# Altium schematic sheet RS485-Interface.SchDoc
size 279 x 320 mm; SheetNumber: 7; SheetTotal: 11
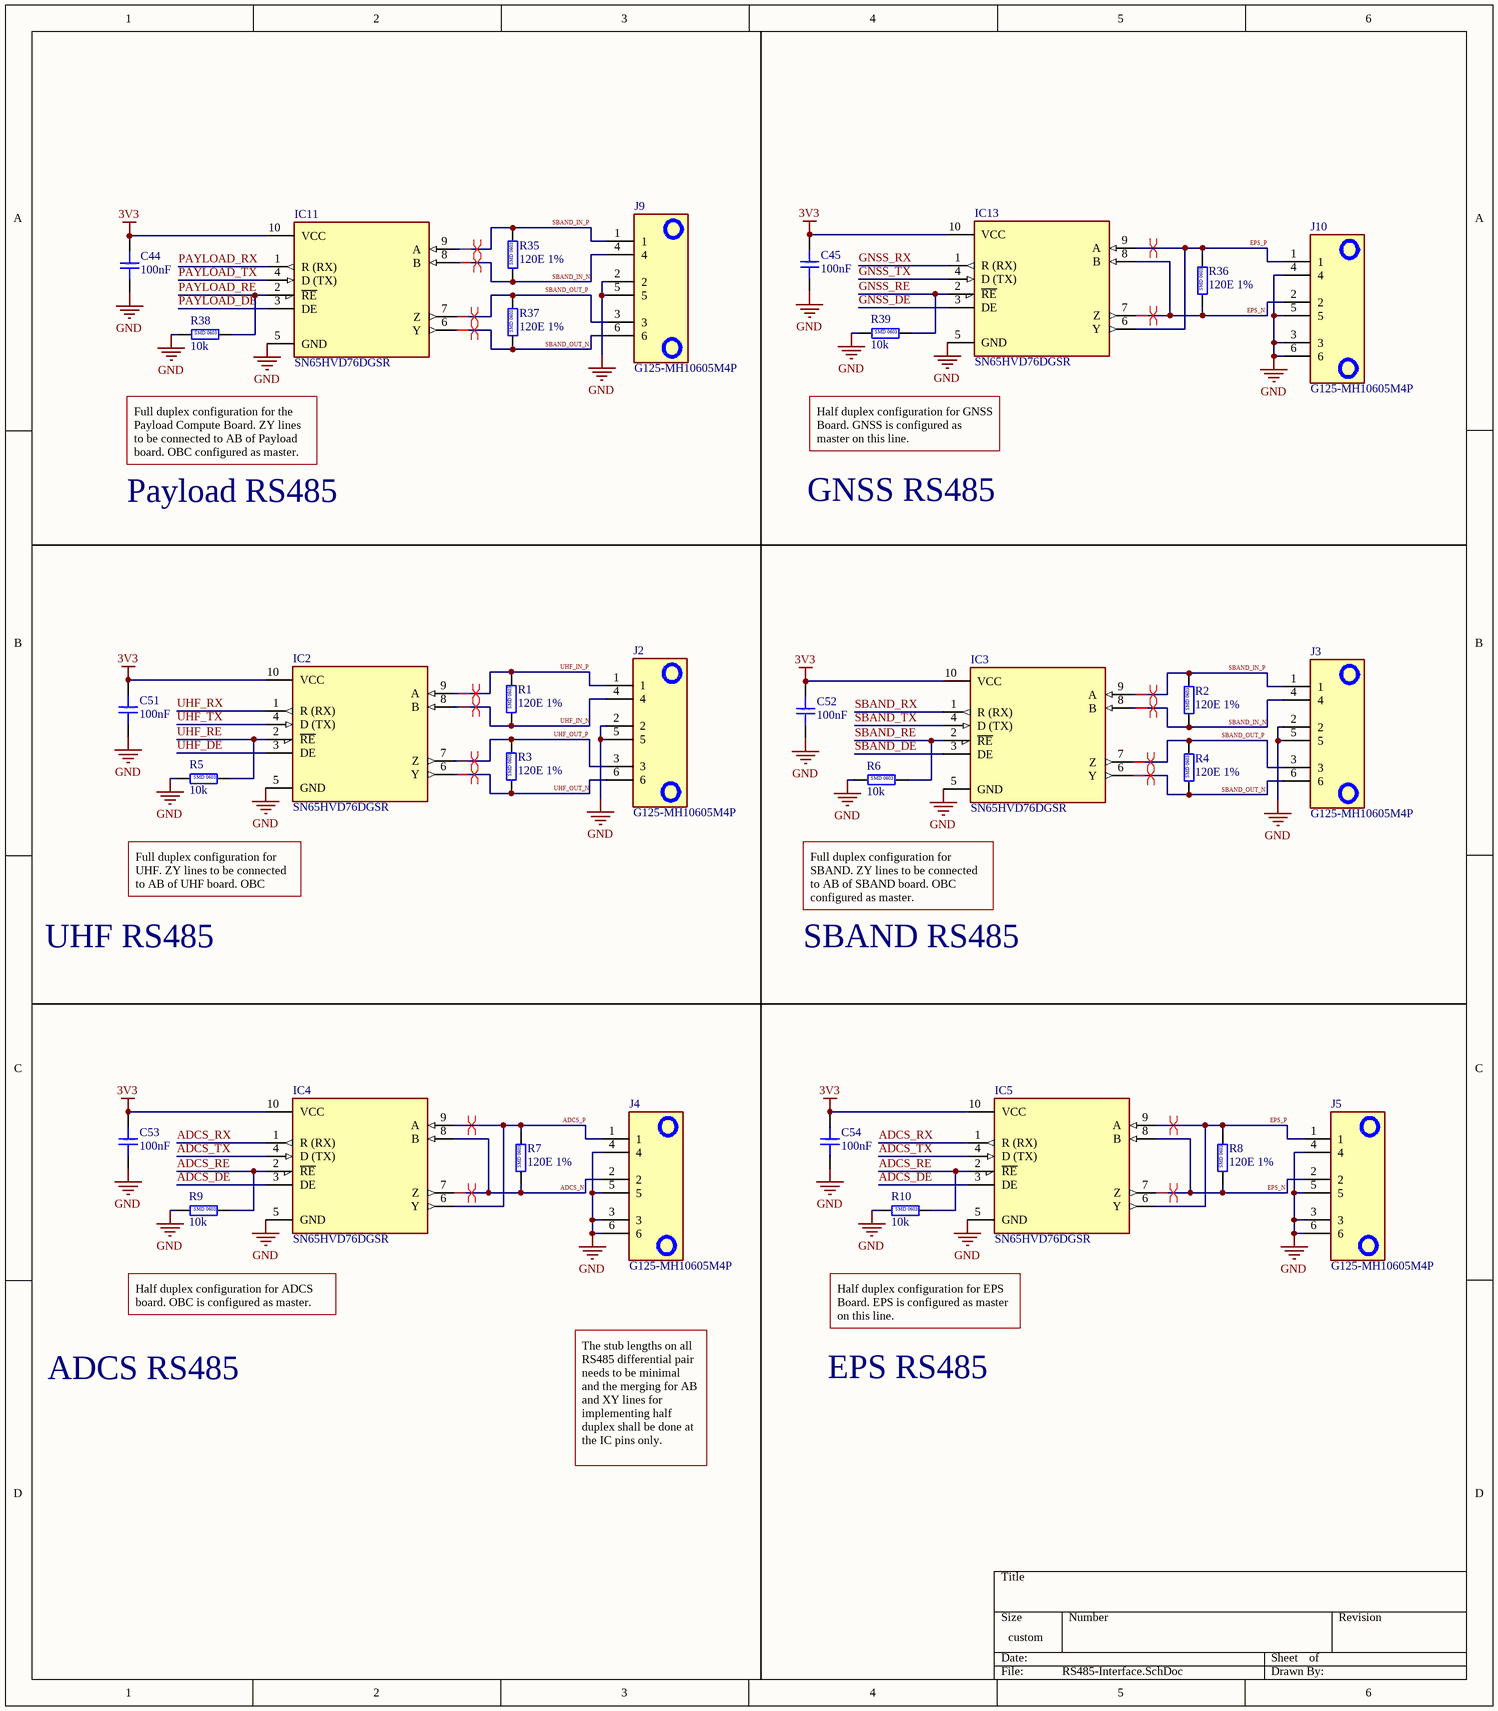
[diagram p0: RS485-Interface.SchDoc]

## Parts
C44  100nF  [CAP_0402]
C45  100nF  [CAP_0402]
C51  100nF  [CAP_0402]
C52  100nF  [CAP_0402]
C53  100nF  [CAP_0402]
C54  100nF  [CAP_0402]
IC2  SN65HVD76DGSR  [SOP50P490X110-10N]
IC3  SN65HVD76DGSR  [SOP50P490X110-10N]
IC4  SN65HVD76DGSR  [SOP50P490X110-10N]
IC5  SN65HVD76DGSR  [SOP50P490X110-10N]
IC11  SN65HVD76DGSR  [SOP50P490X110-10N]
IC13  SN65HVD76DGSR  [SOP50P490X110-10N]
J2  G125-MH10605M4P  [G125-MH10605M4P_1]
J3  G125-MH10605M4P  [G125-MH10605M4P_1]
J4  G125-MH10605M4P  [G125-MH10605M4P_1]
J5  G125-MH10605M4P  [G125-MH10605M4P_1]
J9  G125-MH10605M4P  [G125-MH10605M4P_1]
J10  G125-MH10605M4P  [G125-MH10605M4P_1]
R1  120E 1%  [RES_0603]
R2  120E 1%  [RES_0603]
R3  120E 1%  [RES_0603]
R4  120E 1%  [RES_0603]
R5  10k  [RES_0603]
R6  10k  [RES_0603]
R7  120E 1%  [RES_0603]
R8  120E 1%  [RES_0603]
R9  10k  [RES_0603]
R10  10k  [RES_0603]
R35  120E 1%  [RES_0603]
R36  120E 1%  [RES_0603]
R37  120E 1%  [RES_0603]
R38  10k  [RES_0603]
R39  10k  [RES_0603]

## Nets
3V3: C44.1 C45.1 C51.1 C52.1 C53.1 C54.1 IC2.10(VCC) IC3.10(VCC) IC4.10(VCC) IC5.10(VCC) IC11.10(VCC) IC13.10(VCC)
GND: C44.2 C45.2 C51.2 C52.2 C53.2 C54.2 IC2.5(GND) IC3.5(GND) IC4.5(GND) IC5.5(GND) IC11.5(GND) IC13.5(GND) J2.2 J2.5 J3.2 J3.5 J4.3 J4.4 J4.5 J4.6 J5.3 J5.4 J5.5 J5.6 J9.2 J9.5 J10.3 J10.4 J10.5 J10.6 R5.1 R6.1 R9.1 R10.1 R38.1 R39.1
ADCS_DE: IC4.3(DE) IC5.3(DE)
ADCS_N: IC4.7(Z) IC4.8(B) J4.2 R7.1
ADCS_P: IC4.6(Y) IC4.9(A) J4.1 R7.2
ADCS_RE: IC4.2(~{RE}) IC5.2(~{RE}) R9.2 R10.2
ADCS_RX: IC4.1(R_(RX)) IC5.1(R_(RX))
ADCS_TX: IC4.4(D_(TX)) IC5.4(D_(TX))
EPS_N: IC5.7(Z) IC5.8(B) IC13.7(Z) IC13.8(B) J5.2 J10.2 R8.1 R36.1
EPS_P: IC5.6(Y) IC5.9(A) IC13.6(Y) IC13.9(A) J5.1 J10.1 R8.2 R36.2
GNSS_DE: IC13.3(DE)
GNSS_RE: IC13.2(~{RE}) R39.2
GNSS_RX: IC13.1(R_(RX))
GNSS_TX: IC13.4(D_(TX))
PAYLOAD_DE: IC11.3(DE)
PAYLOAD_RE: IC11.2(~{RE}) R38.2
PAYLOAD_RX: IC11.1(R_(RX))
PAYLOAD_TX: IC11.4(D_(TX))
SBAND_DE: IC3.3(DE)
SBAND_IN_N: IC3.8(B) IC11.8(B) J3.4 J9.4 R2.1 R35.1
SBAND_IN_P: IC3.9(A) IC11.9(A) J3.1 J9.1 R2.2 R35.2
SBAND_OUT_N: IC3.6(Y) IC11.6(Y) J3.6 J9.6 R4.1 R37.1
SBAND_OUT_P: IC3.7(Z) IC11.7(Z) J3.3 J9.3 R4.2 R37.2
SBAND_RE: IC3.2(~{RE}) R6.2
SBAND_RX: IC3.1(R_(RX))
SBAND_TX: IC3.4(D_(TX))
UHF_DE: IC2.3(DE)
UHF_IN_N: IC2.8(B) J2.4 R1.1
UHF_IN_P: IC2.9(A) J2.1 R1.2
UHF_OUT_N: IC2.6(Y) J2.6 R3.1
UHF_OUT_P: IC2.7(Z) J2.3 R3.2
UHF_RE: IC2.2(~{RE}) R5.2
UHF_RX: IC2.1(R_(RX))
UHF_TX: IC2.4(D_(TX))

## Layout directives
differential pair: ADCS_N, ADCS_P, EPS_N, EPS_P, SBAND_IN_N, SBAND_IN_P, SBAND_OUT_N, SBAND_OUT_P, UHF_IN_N, UHF_IN_P, UHF_OUT_N, UHF_OUT_P

## Notes on the sheet
- Half duplex configuration for GNSS Board. GNSS is configured as master on this line.
- Payload RS485
- Full duplex configuration for the Payload Compute Board. ZY lines to be connected to AB of Payload board. OBC configured as master.
- GNSS RS485
- Full duplex configuration for UHF. ZY lines to be connected to AB of UHF board. OBC configured as master
- Full duplex configuration for SBAND. ZY lines to be connected to AB of SBAND board. OBC configured as master.
- UHF RS485
- SBAND RS485
- Half duplex configuration for ADCS board. OBC is configured as master.
- Half duplex configuration for EPS Board. EPS is configured as master on this line.
- ADCS RS485
- EPS RS485
- The stub lengths on all RS485 differential pair needs to be minimal and the merging for AB and XY lines for implementing half duplex shall be done at the IC pins only.
- (in symbol Capacitor-SMD-0402) SMD 0402
- (in symbol Resistor-SMD-0603) SMD 0603

## Library data of the parts
C44 C45 C51-C54 = Capacitor-SMD-0402: Capacitor SMD 0402 RATED
IC2-IC5 IC11 IC13 = SN65HVD76DGSR: RS485 Full Duplex Transciever; Manufacturer_Name: Texas Instruments; Datasheet Link: http://www.ti.com/lit/gpn/sn65hvd76; Height: 1.1mm; Manufacturer_Part_Number: SN65HVD76DGSR; Mouser Part Number: 595-SN65HVD76DGSR; Mouser Price/Stock: https://www.mouser.co.uk/ProductDetail/Texas-Instruments/SN65HVD76DGSR?qs=7z%252BmIopC6%2FI%252B8LLIzcebYw%3D%3D; Arrow Part Number: SN65HVD76DGSR; Arrow Price/Stock: https://www.arrow.com/en/products/sn65hvd76dgsr/texas-instruments?region=nac
J2-J5 J9 J10 = G125-MH10605M4P: Connector; Manufacturer_Name: Harwin; Datasheet Link: https://content.harwin.com/m/667f1be9427fb768/original/DRG-02921-Technical-Drawing-Datasheet-G125-MH1XX05M4P-pdf.pdf; Height: 5.3mm; Manufacturer_Part_Number: G125-MH10605M4P; Mouser Part Number: 855-G125MH1065M4PM4P; Mouser Price/Stock: https://www.mouser.co.uk/ProductDetail/Harwin/G125-MH10605M4P?qs=vHuUswq2%252BswF07IXFR1W6A%3D%3D
R1-R10 R35-R39 = Resistor-SMD-0603: Resistor SMD 0603 RATED